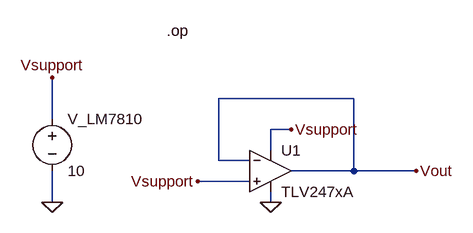
[diagram p0: schematic 15_11_support.asc]
15_11_support.asc, the LTspice schematic file:
Version 4
SHEET 1 880 680
WIRE 544 240 336 240
WIRE 80 272 80 208
WIRE 448 288 416 288
WIRE 416 320 416 288
WIRE 336 336 336 240
WIRE 384 336 336 336
WIRE 544 352 544 240
WIRE 544 352 448 352
WIRE 640 352 544 352
WIRE 384 368 304 368
WIRE 80 400 80 352
WIRE 416 400 416 384
FLAG 416 400 0
FLAG 80 400 0
FLAG 80 208 Vsupport
FLAG 304 368 Vsupport
FLAG 448 288 Vsupport
FLAG 640 352 Vout
SYMBOL Voltage 80 256 R0
SYMATTR InstName V_LM7810
SYMATTR Value 10
SYMBOL opamp2 416 288 R0
SYMATTR InstName U1
SYMATTR Value TLV247xA
TEXT 256 136 Left 2 !.op

The netlist it stands for:
* 15_11_support.asc
V_LM7810 Vsupport 0 10
XU1 Vsupport Vout Vsupport 0 Vout TLV247xA  ; pins In+ In- V+ V- OUT
.op
.backanno
.end